# Altium schematic sheet us_#1sch.SchDoc: #1 extension. DC/DC, HV pulser, MD0100,VGA
size A4
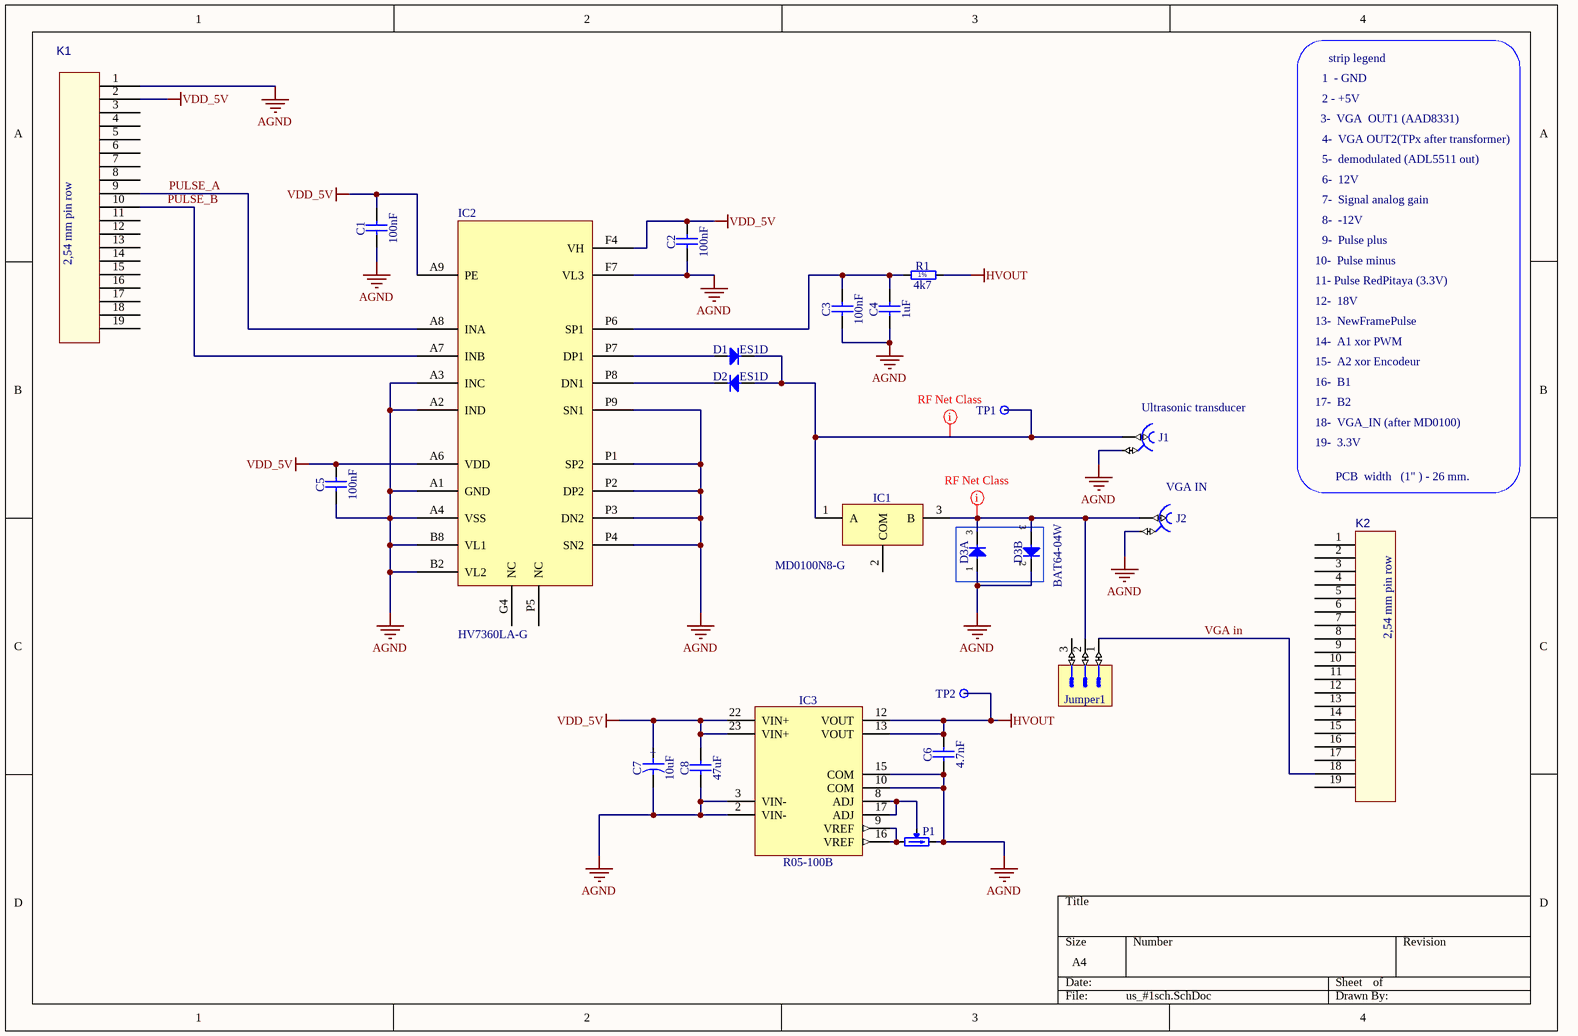
[diagram p0: us_#1sch.SchDoc]

## Parts
C1  100nF  [CAPC1608X87N]
C2  100nF  [CAPC1608X87N]
C3  100nF  [CAPC1608X87N]
C4  1uF  [CAPC5650X165N]
C5  100nF  [CAPC1608X87N]
C6  4.7nF  [CAPC2012X110N]
C7  10uF  [CAPMP3528X210N]
C8  47uF  [CAPC3216X180N]
D1  ES1D  [DIOM5027X244N]
D2  ES1D  [DIOM5027X244N]
D3  BAT64-04W  [SOT65P210X100-3N]  (parts A,B of 2)
IC1  MD0100N8-G  [SOT89]
IC2  HV7360LA-G  [HV7360_BGA]
IC3  R05-100B  [PWS_RECOM_R05-100B]
J1  SMA  [AMPHENOL_132357-11]  (value not drawn)
J2  SMA  [AMPHENOL_132357-11]  (value not drawn)
Jumper1  (no value)  [SULLINS_GRPB031VWVN]
K1  PLS_2.54mm-19  [PLS_2.54mm-19]  (value not drawn)
K2  PLS_2.54mm-19  [PLS_2.54mm-19]  (value not drawn)
P1  5k  [TRIM_BOURNS_3223W]  (value not drawn)
R1  4k7  [RESC3216X65N]
TP1  Test Point  [NICOMATIC_C12000B]  (value not drawn)
TP2  Test Point  [NICOMATIC_C12000B]  (value not drawn)

## Nets
AGND: C1.1 C2.1 C3.1 C4.1 C5.1 C6.1 C7.2 C8.1 D3.1(A) D3.2(C) IC2.A1(GND) IC2.A2(IND) IC2.A3(INC) IC2.A4(VSS) IC2.B2(VL2) IC2.B8(VL1) IC2.F7(VL3) IC2.P1(SP2) IC2.P2(DP2) IC2.P3(DN2) IC2.P4(SN2) IC2.P9(SN1) IC3.2(VIN-) IC3.3(VIN-) IC3.10(COM) IC3.15(COM) J1.2 J2.2 K1.1 P1.3(CW)
HVOUT: C6.2 IC3.12(VOUT) IC3.13(VOUT) R1.2 TP2.1
VDD_5V: C1.2 C2.2 C5.2 C7.1 C8.2 IC2.A6(VDD) IC2.A9(PE) IC2.F4(VH) IC3.22(VIN+) IC3.23(VIN+) K1.2
PULSE_A: IC2.A8(INA) K1.9
PULSE_B: IC2.A7(INB) K1.10
VGA in: Jumper1.1 K2.18
NetC3_2: C3.2 C4.2 IC2.P6(SP1) R1.1
NetD1_1: D1.1(C) D2.2(A) IC1.1(A) J1.1 TP1.1
NetD1_2: D1.2(A) IC2.P7(DP1)
NetD2_1: D2.1(C) IC2.P8(DN1)
NetD3_3: D3.3(COMAC) IC1.3(B) J2.1 Jumper1.2
NetIC3_8: IC3.8(ADJ) IC3.17(ADJ) P1.2(W)
NetIC3_9: IC3.9(VREF) IC3.16(VREF) P1.1(CCW)

Not connected (* = marked no-connect by the designer): IC1 2(COM); IC2 G4(NC) P5(NC); Jumper1 3; K1 3 4 5 6 7 8 11 12 13 14 15 16 17 18 19; K2 1 2 3 4 5 6 7 8 9 10 11 12 13 14 15 16 17 19

## Layout directives
net class RF: NetD1_1, NetD3_3

## Notes on the sheet
- 2 - +5V
- 1  - GND
- strip legend
- 3-  VGA  OUT1 (AAD8331)
- 4-  VGA OUT2(TPx after transformer)
- 5-  demodulated (ADL5511 out)
- 6-  12V
- 7-  Signal analog gain
- 8-  -12V
- 9-  Pulse plus
- 10-  Pulse minus
- 11- Pulse RedPitaya (3.3V)
- 12-  18V
- 13-  NewFramePulse
- 14-  A1 xor PWM
- 15-  A2 xor Encodeur
- 16-  B1
- (near J1) Ultrasonic transducer
- 17-  B2
- 18-  VGA_IN (after MD0100)
- 19-  3.3V
- VGA IN
- PCB  width   (1" ) - 26 mm.
- (in symbol CTE3528-21_10UF_16V_10%_LESR0800) +
- (in symbol PLS_2.54mm-19) 2,54 mm pin row
- (in symbol R1206_4K7_1%_0.25W_100PPM) 1%

## Library data of the parts
C1-C3 C5 = CC0603_100NF_50V_10%_X7R: Non-polarised capacitor; Part Description: SMD Multilayer Chip Ceramic Capacitor; Manufacturer: GENERIC; Manufacturer1 Part Number: 223858615649; Voltage: 50V; TC: X7R; Tolerance: ±10%; Table: Capacitors SMD; Part Number: CC0603_100NF_50V_10%_X7R; Component Kind: Standard; Component Type: Standard; Pin Count: 2; Value: 100nF; Status: Preferred; Manufacturer Part Number: CC0603_100NF_50V_10%_X7R; Case: 0603; Mounted: Yes; Socket: No; SMD: Yes; Manufacturer1 Example: PHYCOMP; Manufacturer1 ComponentHeight: 0.87mm; HelpURL: \\cern.ch\dfs\Applications\Altium\Datasheets\CC0603_X7R_PHYCOMP.pdf; Author: CERN DEM JLC; CreateDate: 12/3/2007; LatestRevisionDate: 12/3/2007
C4 = CC2220_1UF_200V_10%_X7R: Non-polarised capacitor; Part Description: SMD Ceramic Chip Capacitor; Manufacturer: GENERIC; Manufacturer1 Part Number: C2220X105K2RAC; Voltage: 200V; TC: X7R; Tolerance: ±10%; Table: Capacitors SMD; Part Number: CC2220_1UF_200V_10%_X7R; Component Kind: Standard; Component Type: Standard; Pin Count: 2; Value: 1uF; Status: None; Manufacturer Part Number: CC2220_1UF_200V_10%_X7R; Case: 2220; Mounted: Yes; Socket: No; SMD: Yes; Manufacturer1 Example: KEMET; Manufacturer1 ComponentHeight: 1.65mm; HelpURL: \\cern.ch\dfs\Applications\Altium\Datasheets\CC2220_X7R_KEMET.pdf; Author: CERN DEM JLC; CreateDate: 9/16/2009; LatestRevisionDate: 9/16/2009
C6 = CC0805_4.7NF_250V_10%_X7R: Non-polarised capacitor; Part Description: SMD Multilayer Chip Ceramic Capacitor; Manufacturer: GENERIC; Manufacturer1 Part Number: GRM21AR72E472KW01D; Voltage: 250V; TC: X7R; Tolerance: ±10%; Table: Capacitors SMD; Part Number: CC0805_4.7NF_250V_10%_X7R; Component Kind: Standard; Component Type: Standard; Pin Count: 2; Value: 4.7nF; Status: Preferred; Manufacturer Part Number: CC0805_4.7NF_250V_10%_X7R; Case: 0805; Mounted: Yes; Socket: No; SMD: Yes; Manufacturer1 Example: MURATE; Manufacturer1 ComponentHeight: 1.1mm; Author: S. Jafar; CreateDate: 12/21/2015; LatestRevisionDate: 1/10/2016
C7 = CTE3528-21_10UF_16V_10%_LESR0800: Polarised capacitor; Part Description: Low ESR 0R8 Solid Tantalum Chip Capacitor; Manufacturer: GENERIC; Manufacturer1 Part Number: TPSB106K016R0800; Voltage: 16V; Tolerance: ±10%; Table: Capacitors SMD; Part Number: CTE3528-21_10UF_16V_10%_LESR0800; Component Kind: Standard; Component Type: Standard; Pin Count: 2; Value: 10uF; Status: Preferred; Manufacturer Part Number: CTE3528-21_10UF_16V_10%_LESR0800; Case: B; Mounted: Yes; Socket: No; SMD: Yes; Manufacturer1 Example: AVX; Manufacturer1 ComponentHeight: 2.1mm; HelpURL: \\cern.ch\dfs\Applications\Altium\Datasheets\CTE-LESR_AVX_TPS.pdf; Author: CERN DEM JLC; CreateDate: 5/5/2008; LatestRevisionDate: 1/20/2009
C8 = CC1206_47UF_25V_20%_X5R: Non-polarised capacitor; Part Description: SMD Multilayer Chip Ceramic Capacitor; Manufacturer: TDK; Manufacturer Part Number: C3216X5R1E476M160AC; Voltage: 25V; TC: X5R; Tolerance: ±20%; Table: Capacitors SMD; Part Number: CC1206_47UF_25V_20%_X5R; Component Kind: Standard; Component Type: Standard; Pin Count: 2; Value: 47uF; Status: None; Case: 1206; Mounted: Yes; Socket: No; SMD: Yes; ComponentHeight: 1.8mm; HelpURL: \\cern.ch\dfs\Applications\Altium\Datasheets\CC1206_X5R_TDK_C.pdf; Author: CERN DEM JLC; CreateDate: 11/20/2013; LatestRevisionDate: 11/20/2013
D1 D2 = ES1D: Diode; Part Description: Fast Rectifier; Manufacturer: FAIRCHILD SEMICONDUCTOR; Voltage: 200V; Power: 1A; Table: Diodes; Part Number: ES1D; Component Kind: Standard; Component Type: Standard; Device: ES1D; PackageDescription: DO-214-AC/SMA  Molded Diode, Body 5.0x2.7mm, IPC Medium Density; Manufacturer Part Number: ES1D; Pin Count: 2; Case: DO-214AC; Mounted: Yes; Socket: No; SMD: Yes; ComponentHeight: 2.44mm; HelpURL: \\cern.ch\dfs\Applications\Altium\Datasheets\ES1D.pdf; Author: CERN DEM JLC; CreateDate: 5/6/2008; LatestRevisionDate: 5/6/2008
D3 = BAT64-04W: Serial Diode; Part Description: Silicon Schottky Double Diode; Manufacturer: INFINEON; Voltage: 40V; Power: 250mW; Table: Diodes; Part Number: BAT64-04W; Component Kind: Standard; Component Type: Standard; Device: BAT64-04W; PackageDescription: SOT323, 0.65mm pitch; 3 pin, 1.25mm W X 2.00mm L, IPC Medium Density; Manufacturer Part Number: BAT64-04W; Pin Count: 3; Case: SOT323; Mounted: Yes; Socket: No; SMD: Yes; ComponentHeight: 1mm; HelpURL: \\cern.ch\dfs\Applications\Altium\Datasheets\BAT64-04W.pdf; Author: CERN DEM JMW; CreateDate: 1/8/2009; LatestRevisionDate: 1/8/2009
IC1 = MD0100N8-G: 3-Ultra-Sound HV Switch 1=A 2=COM 3=B; Manufacturer: Supertex inc.; Table: Analog & Interface; Part Number: MD0100N8-G; Component Kind: Standard; Component Type: Standard; Device: MD0100N8-G; PackageDescription: SOT89-3, 3-Leads, Body 2.44x4.5mm; Part Description: Ultra-Sound HV Switch; Manufacturer Part Number: MD0100N8-G; Pin Count: 4; Case: SOT89; Mounted: Yes; Socket: No; SMD: Yes; ComponentHeight: 1.6mm; Author: S. Jafar; CreateDate: 12/20/2015; LatestRevisionDate: 1/6/2016
IC2 = HV7360_BGA: Part Description: High Speed, ±100V 2.5A Two or Three Level Ultrasound Pulser; Manufacturer: Supertex inc.; Table: Analog & Interface; Part Number: HV7360LA-G; Component Kind: Standard; Component Type: Standard; Device: HV7360LA-G; Footprint: HV7360; PackageDescription: High Speed, ±100V 2.5A Two or Three Level Ultrasound Pulser; Manufacturer Part Number: HV7360LA-G; Pin Count: 22; Case: LFGA-22; Mounted: Yes; Socket: No; SMD: Yes; ComponentHeight: 0.85; Author: S. Jafar; CreateDate: 12/20/2015; LatestRevisionDate: 1/6/2016
IC3 = PWS_RECOM_R05-100B: Power Supply; Part Description: +5VDC to +55-135VDC 5W Power Supply; Manufacturer: RECOM POWER; Table: Power Supplies; Part Number: R05-100B; Component Kind: Standard; Component Type: Standard; Device: R05-100B; PackageDescription: 55-135V 5W Power Supply, Body 32x21mm; Status: None; Manufacturer Part Number: R05-100B; Pin Count: 12; Mounted: Yes; Socket: No; SMD: No; ComponentHeight: 9.4mm; Author: S. Jafar; CreateDate: 12/21/2015; LatestRevisionDate: 12/21/2015
J1 J2 = AMPHENOL_132357-11: Part Description: SMA End Launch Jack for 1.58mm PCB, 50 Ohm, Flat Tab Contact; Part Number: AMPHENOL_132357-11; Component Kind: Standard; Component Type: Standard; Pin Count: 2; Family: SMA; Mounted: Yes; Socket: No; SMD: Yes; Status: None; Manufacturer: AMPHENOL; Manufacturer Part Number: 132357-11; ComponentHeight: 7.92mm; HelpURL: \\cern.ch\dfs\Applications\Altium\Datasheets\AMPHENOL_132357-11.pdf; Author: CERN DEM JLC; CreateDate: 5/14/2012; LatestRevisionDate: 5/14/2012; Table: AMPHENOL
Jumper1 = Connector 3 Male: Part Description: 3 Contact 0.5" Pitch Single-In-Line Vertical Header; Manufacturer: SULLINS; Manufacturer Part Number: GRPB031VWVN; Table: Miscellaneous; Part Number: SULLINS_GRPB031VWVN; Component Kind: Standard; Component Type: Standard; Pin Count: 3; Mounted: Yes; Socket: No; SMD: No; Status: None; ComponentHeight: 4mm; Author: S. Jafar; CreateDate: 12/29/2015; LatestRevisionDate: 12/29/2015
P1 = TRIM_11T_5K_BOURNS_3223W-1-502E: Trimming Potentiometer; Part Description: 11 Turns SMD Trimpot® Trimming Potentiometer (Top Adjust); Manufacturer: BOURNS; Power: 0.125W; TC: ±100ppm/°C; Tolerance: ±20%; Table: Potentiometers SMD; Part Number: TRIM_11T_5K_BOURNS_3223W-1-502E; Component Kind: Standard; Component Type: Standard; Pin Count: 3; Value: 5k; Manufacturer Part Number: 3223W-1-502E; Case: 3223W; Mounted: Yes; Socket: No; SMD: Yes; ComponentHeight: 4.16mm; HelpURL: \\cern.ch\dfs\Applications\Altium\Datasheets\TRIM_BOURNS_3223W.pdf; Author: CERN DEM JLC; CreateDate: 3/31/2011; LatestRevisionDate: 12/18/2012
R1 = R1206_4K7_1%_0.25W_100PPM: Resistor - 1%; Part Description: General Purpose Thick Film Chip Resistor; Manufacturer: GENERIC; Manufacturer1 Part Number: NRC12F4701TRF; Power: 0.25W; TC: ±100ppm/°C; Table: Resistors SMD; Part Number: R1206_4K7_1%_0.25W_100PPM; Component Kind: Standard; Component Type: Standard; Pin Count: 2; Value: 4k7; Status: Preferred; Tolerance: ±1%; Manufacturer Part Number: R1206_4K7_1%_0.25W_100PPM; Case: 1206; Mounted: Yes; Socket: No; SMD: Yes; Manufacturer1 Example: NIC COMPONENT; Manufacturer1 ComponentHeight: 0.65mm; HelpURL: \\cern.ch\dfs\Applications\Altium\Datasheets\R1206_NIC_NRC.pdf; Author: CERN DEM JLC; CreateDate: 12/3/2007; LatestRevisionDate: 3/13/2008
TP1 TP2 = NICOMATIC_C12000B: Part Description: SMD Test Point; Table: Miscellaneous; Part Number: NICOMATIC_C12000B; Component Kind: Standard; Component Type: Standard; Pin Count: 1; Family: Test Point; Mounted: Yes; Socket: No; SMD: Yes; Status: None; Manufacturer: NICOMATIC; Manufacturer Part Number: C12000B; ComponentHeight: 1.5mm; HelpURL: \\cern.ch\dfs\Applications\Altium\Datasheets\NICOMATIC_C12000B.pdf; Author: CERN DEM JLC; CreateDate: 3/25/2009; LatestRevisionDate: 3/25/2009